# Altium schematic sheet rev02_24.SchDoc
size 282 x 200 mm
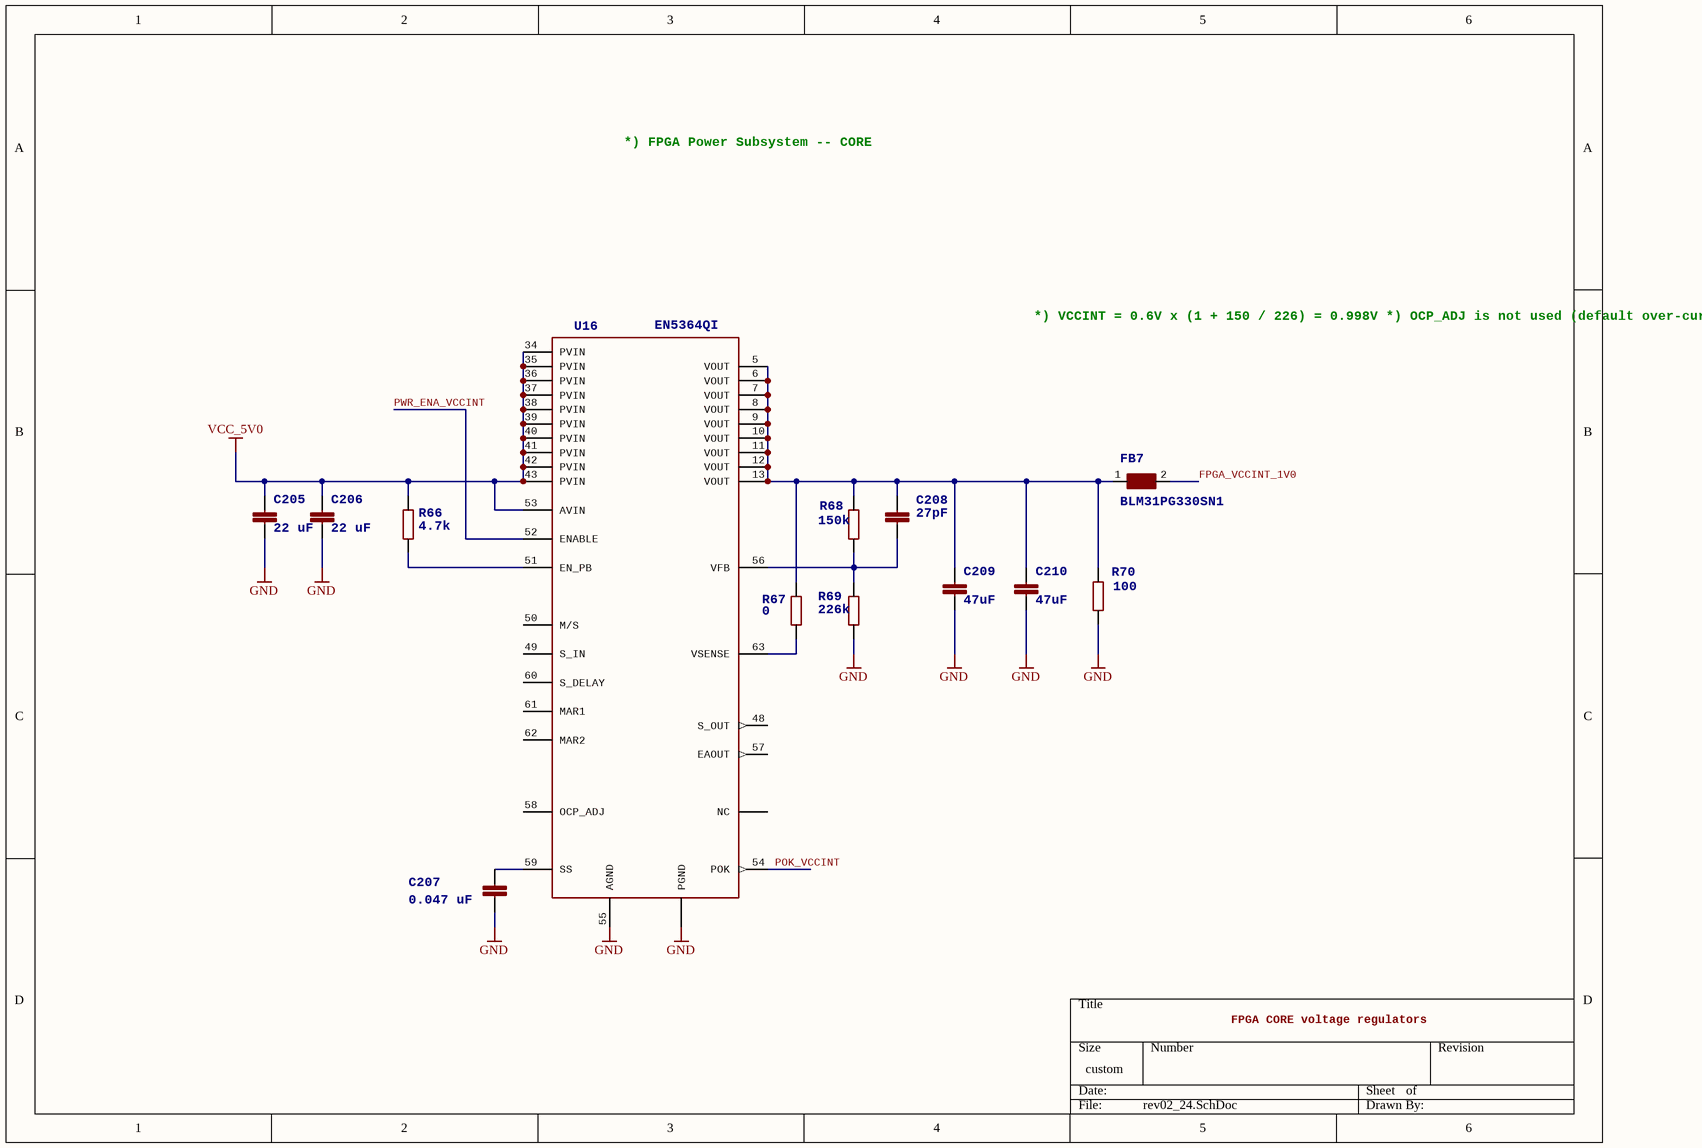
[diagram p0: rev02_24.SchDoc]

## Parts
C205  value 22 uF  >NAME: C205  [C_1210]  (hidden comment: C3225X5R1C226M250AA)
C206  value 22 uF  >NAME: C206  [C_1210]  (hidden comment: C3225X5R1C226M250AA)
C207  value 0.047 uF  [C_0402]
C208  value 27pF  >NAME: C208  [C_0402]
C209  value 47uF  >NAME: C209  [C_1210]  (hidden comment: GRM32ER70J476ME20L)
C210  value 47uF  >NAME: C210  [C_1210]  (hidden comment: GRM32ER70J476ME20L)
FB7  BLM31PG330SN1  [L_1206]
R66  value 4.7k  >NAME: R66  [R_0402]
R67  value 0  >NAME: R67  [R_0402]
R68  value 150k  >NAME: R68  [R_0402]
R69  value 226k  >NAME: R69  [R_0402]
R70  value 100  >NAME: R70  [R_0402]
U16  EN5364QI  [QFN68]

## Nets
GND: C205.2 C206.2 C207.2 C209.2 C210.2 R69.1 R70.1 U16.1(PGND) U16.2(PGND) U16.3(PGND) U16.4(PGND) U16.27(PGND) U16.28(PGND) U16.29(PGND) U16.30(PGND) U16.31(PGND) U16.32(PGND) U16.33(PGND) U16.55(AGND) U16.64(PGND) U16.65(PGND) U16.66(PGND) U16.67(PGND) U16.68(PGND) U16.PAD69(PGND) U16.PAD70(PGND)
VCC_5V0: C205.1 C206.1 R66.2 U16.34(PVIN) U16.35(PVIN) U16.36(PVIN) U16.37(PVIN) U16.38(PVIN) U16.39(PVIN) U16.40(PVIN) U16.41(PVIN) U16.42(PVIN) U16.43(PVIN) U16.53(AVIN)
FPGA_VCCINT_1V0: FB7.2
POK_VCCINT: U16.54(POK)
PWR_ENA_VCCINT: U16.52(ENABLE)
NetC207_1: C207.1 U16.59(SS)
NetC208_1: C208.1 C209.1 C210.1 FB7.1 R67.2 R68.2 R70.2 U16.5(VOUT) U16.6(VOUT) U16.7(VOUT) U16.8(VOUT) U16.9(VOUT) U16.10(VOUT) U16.11(VOUT) U16.12(VOUT) U16.13(VOUT)
NetC208_2: C208.2 R68.1 R69.2 U16.56(VFB)
NetR66_1: R66.1 U16.51(EN_PB)
NetR67_1: R67.1 U16.63(VSENSE)

Not connected (* = marked no-connect by the designer): U16 14(NC) 15(NC) 16(NC) 17(NC) 18(NC) 19(NC) 20(NC) 21(NC) 22(NC) 23(NC) 24(NC) 25(NC) 26(NC) 44(NC) 45(NC) 46(NC) 47(NC) 48(S_OUT) 49(S_IN) 50(M/S) 57(EAOUT) 58(OCP_ADJ) 60(S_DELAY) 61(MAR1) 62(MAR2)

## Notes on the sheet
- *) FPGA Power Subsystem -- CORE
- *) VCCINT = 0.6V x (1 + 150 / 226) = 0.998V
  *) OCP_ADJ is not used (default over-current threshold)
  *) MARx are not used (output at nominal 100%)
  *) S_IN/S_OUT are not used (single regulator mode)
  *) S_DELAY is not used (single regulator mode)
  *) M/S is not used (parallel operation not needed)
  *) EA_OUT is not used (default control loop)
  *) Minimal load current is 0A, but we still place
  load of 100 Ohms just in case (gives 10 mA)
- FPGA CORE voltage regulators

## Library data of the parts
C205 C206 = C-EUC1210: 1210 CAPACITOR; DIELECTRIC: X5R; RATED_VOLTAGE: 16V; TOLERANCE: 20%
C207 = C-EUC0402: 0402 CAPACITOR; DIELECTRIC: X7R; RATED_VOLTAGE: 50V; TOLERANCE: 10%; >NAME: C116
C208 = C-EUC0402: 0402 CAPACITOR; DIELECTRIC: C0G; RATED_VOLTAGE: 50V; TOLERANCE: 5%
C209 C210 = C-EUC1210: 1210 CAPACITOR X5R 6.3V; RATED_VOLTAGE: 16V; TOLERANCE: 20%; DIELECTRIC: X5R
FB7 = BLM31PG330SN1_1206
R66 R67 R70 = R-EU_R0402: 0402 Resistor 5%
  R66 R70: TOLERANCE: 5%
R68 R69 = R-EU_R0402: 0402 Resistor 1%; TOLERANCE: 1%
U16 = EN5364QI: 6A PowerSoC / Voltage Mode Synchronous Buck PWM DC-DC Converter / With Integrated Inductor; >NAME: U16; MPN: EN5364QI; OC_FARNELL: 2081142; PACKAGE: QFN; SUPPLIER: ENPIRION